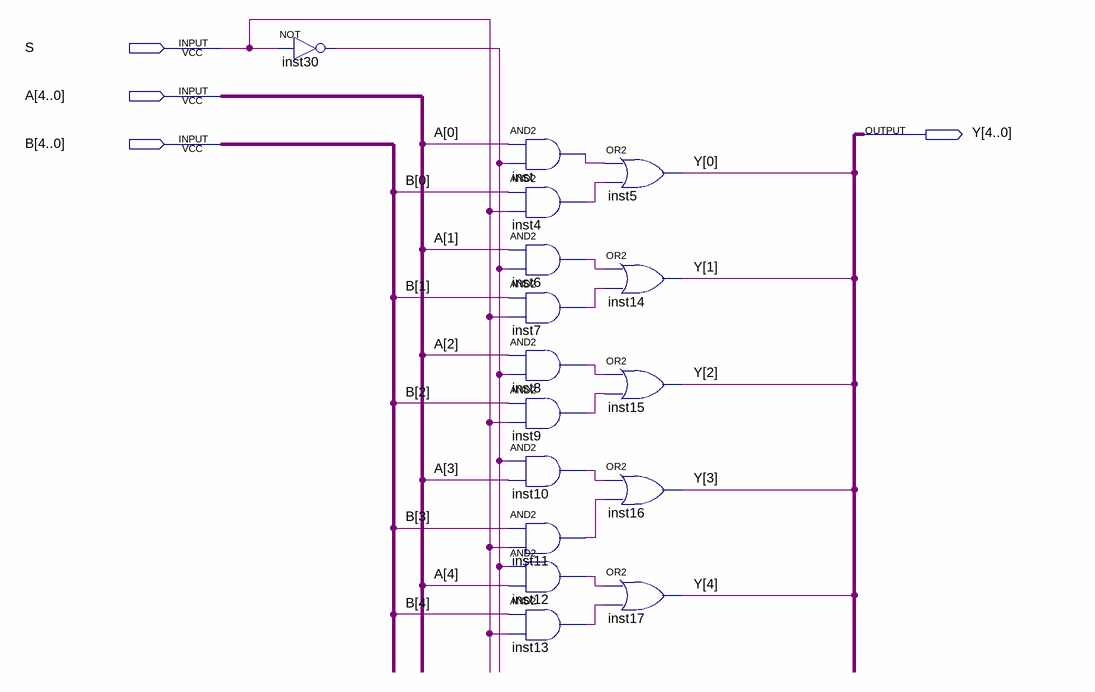
[diagram p0: schematic sheet]
// Quartus schematic MUX2X1_5bits.bdf as structural Verilog: 16 symbols, 4 pins
module MUX2X1_5bits (
  input  S,
  input  [4:0] A,
  input  [4:0] B,
  output [4:0] Y
);

  wire inst4_out, inst6_out, inst7_out, inst8_out, inst9_out, inst10_out, inst11_out, inst12_out, inst13_out,
       inst30_out, inst_out;

  not inst30 (inst30_out, S);
  and inst (inst_out, A[0], inst30_out);
  and inst4 (inst4_out, B[0], S);
  and inst6 (inst6_out, A[1], inst30_out);
  and inst7 (inst7_out, B[1], S);
  and inst8 (inst8_out, A[2], inst30_out);
  and inst9 (inst9_out, B[2], S);
  and inst10 (inst10_out, inst30_out, A[3]);
  and inst11 (inst11_out, B[3], S);
  and inst12 (inst12_out, inst30_out, A[4]);
  and inst13 (inst13_out, B[4], S);
  or inst5 (Y[0], inst_out, inst4_out);
  or inst14 (Y[1], inst6_out, inst7_out);
  or inst15 (Y[2], inst8_out, inst9_out);
  or inst16 (Y[3], inst10_out, inst11_out);
  or inst17 (Y[4], inst12_out, inst13_out);
endmodule
